# Altium schematic sheet Audio-Beamformer_USB_V1.0.SchDoc: Audio-Beamformer
size A4; PageSetup: Record=PageOptions|CenterHorizontal=True|CenterVertical=True|PrintScale=0.97|XCorrection=1.00|YCorrection=1.00|PrintKind=0|BorderSize=5000000|LeftOffset=0|BottomOffset=0|Orientation=2|PaperLength=1000|PaperWidth=1000|Scale=100|PaperSource=7|PrintQuality=-3|MediaType=1|DitherType=10|PrintScaleMode=1|PaperKind=A4|PaperIndex=9; Organization: Ostschweizer Fachhochschule; Address2: Florian Baumgartner & Thierry Schwaller; Address3: florian.baumgartner@ost.ch; DocumentNumber: 7; Revision: V1.0; SheetNumber: 7; SheetTotal: 10; Author: Florian Baumgartner & Thierry Schwaller; Subtitle: USB
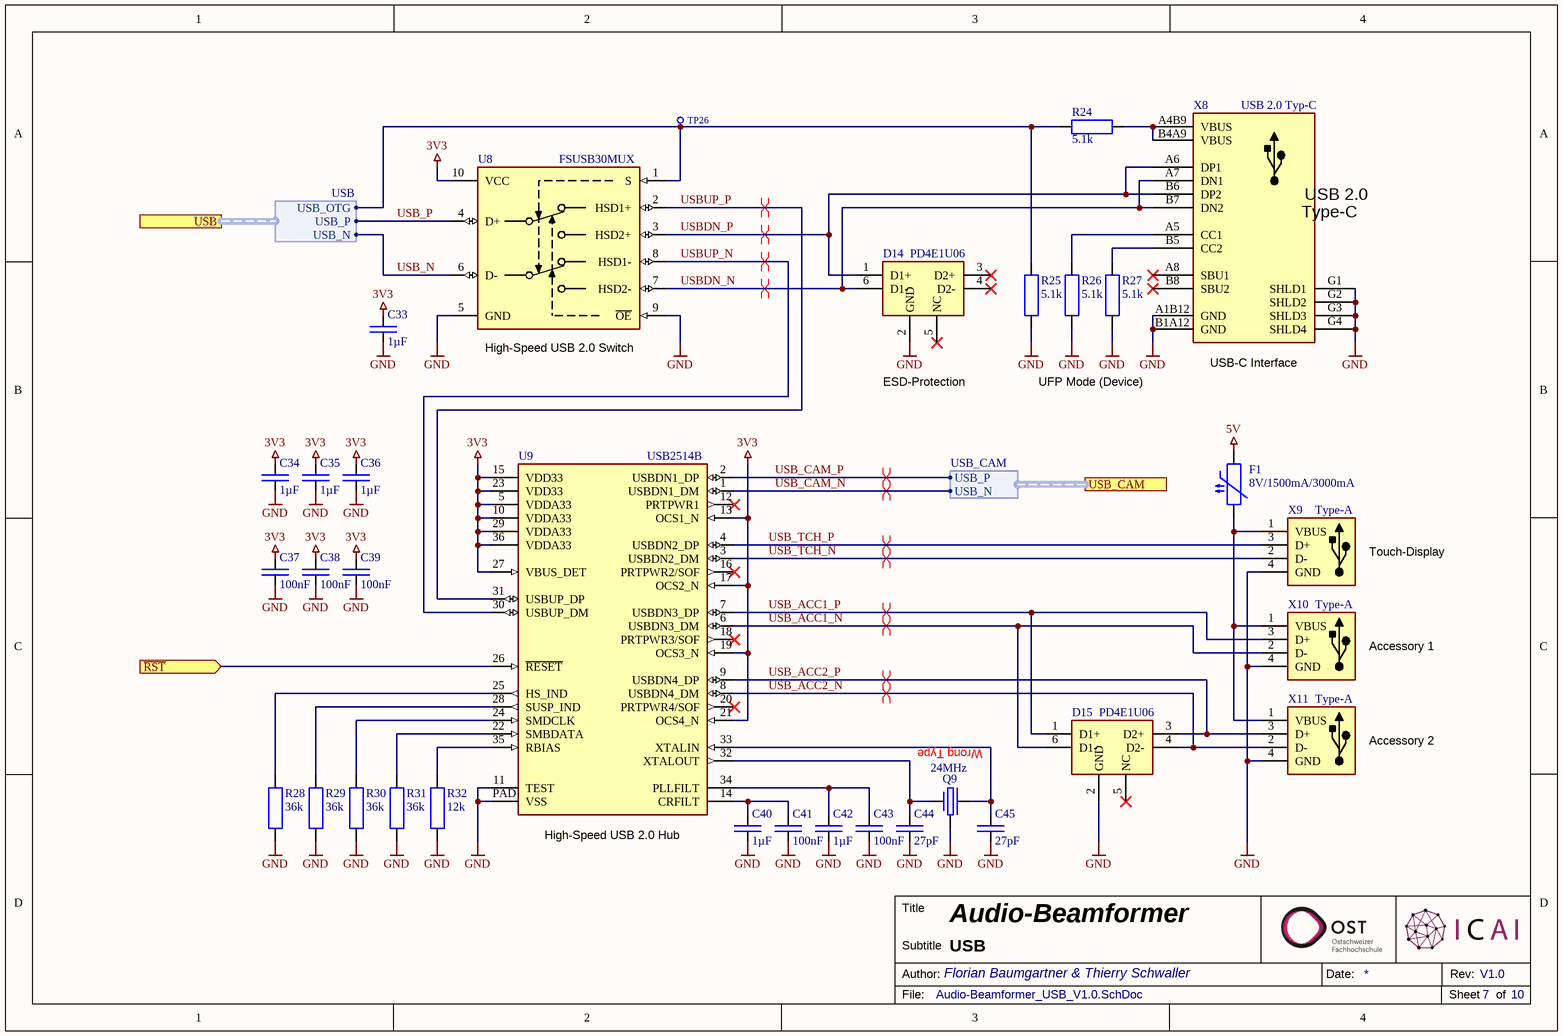
[diagram p0: Audio-Beamformer_USB_V1.0.SchDoc]

## Parts
C33  1µF  [SMD Keramikkondensator 0603]
C34  1µF  [SMD Keramikkondensator 0603]
C35  1µF  [SMD Keramikkondensator 0603]
C36  1µF  [SMD Keramikkondensator 0603]
C37  100nF  [SMD Keramikkondensator 0603]
C38  100nF  [SMD Keramikkondensator 0603]
C39  100nF  [SMD Keramikkondensator 0603]
C40  1µF  [SMD Keramikkondensator 0603]
C41  100nF  [SMD Keramikkondensator 0603]
C42  1µF  [SMD Keramikkondensator 0603]
C43  100nF  [SMD Keramikkondensator 0603]
C44  27pF  [SMD Keramikkondensator 0603]
C45  27pF  [SMD Keramikkondensator 0603]
D14  PD4E1U06  [SMD IC SOT-363 (SC-70-6)]
D15  PD4E1U06  [SMD IC SOT-363 (SC-70-6)]
F1  8V/1500mA/3000mA  [SMD PPTC-Fuse 1206]
Q9  24MHz  [SMD Crystal 3.2X2.5X0.8]
R24  5.1k  [SMD Widerstand 0603]
R25  5.1k  [SMD Widerstand 0603]
R26  5.1k  [SMD Widerstand 0603]
R27  5.1k  [SMD Widerstand 0603]
R28  36k  [SMD Widerstand 0603]
R29  36k  [SMD Widerstand 0603]
R30  36k  [SMD Widerstand 0603]
R31  36k  [SMD Widerstand 0603]
R32  12k  [SMD Widerstand 0603]
TP26  X-TP  [THT Testpunkt Ø1mm]  (value not drawn)  (no BOM)
U8  FSUSB30MUX  [SMD IC MSOP-10]
U9  USB2514B  [SMD IC VFQFN-36]
X8  USB 2.0 Typ-C  [SMD USB-C Socket (A40-00119)]
X9  Type-A  [THT USB-A (292303-1)]
X10  Type-A  [THT USB-A (292303-1)]
X11  Type-A  [THT USB-A (292303-1)]

## Ports
USB (harness USB), USB_CAM (harness USB_CAM), ~{RST} (in)

## Harnesses
USB_CAM: USB_N, USB_P
USB: USB_N, USB_P, USB_OTG

## Nets
3V3: C33.2 C34.2 C35.2 C36.2 C37.2 C38.2 C39.2 U8.10(VCC) U9.5(VDDA33) U9.10(VDDA33) U9.13(OCS1_N) U9.15(VDD33) U9.17(OCS2_N) U9.19(OCS3_N) U9.21(OCS4_N) U9.23(VDD33) U9.27(VBUS_DET) U9.29(VDDA33) U9.36(VDDA33)
5V: F1.2
GND: C33.1 C34.1 C35.1 C36.1 C37.1 C38.1 C39.1 C40.1 C41.1 C42.1 C43.1 C44.2 C45.2 D14.2(GND) D15.2(GND) Q9.3 R25.2 R26.2 R27.2 R28.1 R29.1 R30.1 R31.1 R32.1 U8.5(GND) U8.9(~{OE}) U9.11(TEST) U9.PAD(VSS) X8.A1B12(GND) X8.B1A12(GND) X8.G1(SHLD1) X8.G2(SHLD2) X8.G3(SHLD3) X8.G4(SHLD4) X9.4(GND) X10.4(GND) X11.4(GND)
~{RST}: U9.26(~{RESET}) ; port ~{RST}
USB_ACC1_N: D15.6(D1-) U9.6(USBDN3_DM) X10.2(D-)
USB_ACC1_P: D15.1(D1+) U9.7(USBDN3_DP) X10.3(D+)
USB_ACC2_N: D15.4(D2-) U9.8(USBDN4_DM) X11.2(D-)
USB_ACC2_P: D15.3(D2+) U9.9(USBDN4_DP) X11.3(D+)
USB_CAM_N: U9.1(USBDN1_DM) ; port USB_CAM.USB_N
USB_CAM_P: U9.2(USBDN1_DP) ; port USB_CAM.USB_P
USB_N: U8.6(D-) ; port USB.USB_N
USB_P: U8.4(D+) ; port USB.USB_P
USB_TCH_N: U9.3(USBDN2_DM) X9.2(D-)
USB_TCH_P: U9.4(USBDN2_DP) X9.3(D+)
USBDN_N: D14.6(D1-) U8.7(HSD2-) X8.A7(DN1) X8.B7(DN2)
USBDN_P: D14.1(D1+) U8.3(HSD2+) X8.A6(DP1) X8.B6(DP2)
USBUP_N: U8.8(HSD1-) U9.30(USBUP_DM)
USBUP_P: U8.2(HSD1+) U9.31(USBUP_DP)
NetC40_2: C40.2 C41.2 U9.14(CRFILT)
NetC42_2: C42.2 C43.2 U9.34(PLLFILT)
NetC44_1: C44.1 Q9.1 U9.32(XTALOUT)
NetC45_1: C45.1 Q9.2 U9.33(XTALIN)
NetF1_1: F1.1 X9.1(VBUS) X10.1(VBUS) X11.1(VBUS)
NetR24_1: R24.1 R25.1 TP26.1 U8.1(NC) ; port USB.USB_OTG
NetR24_2: R24.2 X8.A4B9(VBUS) X8.B4A9(VBUS)
NetR26_1: R26.1 X8.A5(CC1)
NetR27_1: R27.1 X8.B5(CC2)
NetR28_2: R28.2 U9.25(HS_IND)
NetR29_2: R29.2 U9.28(SUSP_IND)
NetR30_2: R30.2 U9.24(SMDCLK)
NetR31_2: R31.2 U9.22(SMBDATA)
NetR32_2: R32.2 U9.35(RBIAS)

Not connected (* = marked no-connect by the designer): D14 3(D2+)* 4(D2-)* 5(NC)*; D15 5(NC)*; U9 12(PRTPWR1)* 16(PRTPWR2/SOF)* 18(PRTPWR3/SOF)* 20(PRTPWR4/SOF)*; X8 A8(SBU1)* B8(SBU2)*

## Layout directives
differential pair: USB_ACC1_N, USB_ACC1_P, USB_ACC2_N, USB_ACC2_P, USB_CAM_N, USB_CAM_P, USB_TCH_N, USB_TCH_P, USBDN_N, USBDN_P, USBUP_N, USBUP_P

## Notes on the sheet
- (near U8) High-Speed USB 2.0 Switch
- ESD-Protection
- UFP Mode (Device)
- (near X8) USB-C Interface
- Touch-Display
- Accessory 1
- (near Q9) Wrong Type
- Accessory 2
- (near U9) High-Speed USB 2.0 Hub
- Title
- Author:
- Subtitle
- Date:
- Rev:
- File:
- Sheet
- of
- (in symbol X-USB-Buchse) USB 2.0; Type-C

## Library data of the parts
C33-C36 C40 C42 = E6 - 1uF: SMD Ceramic Capacitor E6; Component Value: 1µF 50V; Component Description: Multilayer Ceramic Capacitors MLCC; ComponentLink1Description: Datasheet; ComponentLink1URL: https://datasheet.lcsc.com/lcsc/1810261812_Samsung-Electro-Mechanics-CL10A105KB8NNNC_C15849.pdf; Digikey: 1276-1860-1-ND; Farnell: 3013383; JLC-Parts: C15849; Mouser: 187-CL10A105KB8NNNC; Unit Price: 0.01
C37-C39 C41 C43 = C-CAPACITOR: CAP-MK; Component Description: Multilayer Ceramic Capacitors; Component Value: 100nF 50V; Digikey: 445-5666-1-ND; Farnell: 2522432; Mouser: 77-VJ0603V104ZXAPBC; JLC-Parts: C14663; Unit Price: 0.01
C44 C45 = C-CAPACITOR: CAP-MK; Component Description: Multilayer Ceramic Capacitors; Component Value: 27pF 50V; Digikey: 399-C0603C270J5GAC7867CT-ND; Farnell: 1414627; Mouser: 80-C0603C270J5G; JLC-Parts: C1656; Unit Price: 0.01
D14 D15 = PD4E1U06DCKR: Unidirectional 3A (8/20us) 15V (Typ) 6.5V 5.5V (Max) SOT-363 ESD Protection Devices ROHS; Component Description: ESD Suppressor; ComponentLink1Description: Datasheet; ComponentLink1URL: https://datasheet.lcsc.com/lcsc/1810172210_Texas-Instruments-TPD4E1U06DCKR_C194628.pdf; Component Value: PD4E1U06; Digikey: 296-39347-1-ND; Farnell: 3116516; JLC-Parts: C194628; Mouser: 595-TPD4E1U06DCKR; Unit Price: 0.12
F1 = nSMD020-30V: 8V/1500mA/3000mA Resettable Fuses; Component Value: 8V/1500mA/3000mA/100ms; Component Description: PTC Resettable Fuse; ComponentLink1Description: Datasheet; ComponentLink1URL: https://www.littelfuse.com/~/media/electronics/datasheets/resettable_ptcs/littelfuse_ptc_1206l_datasheet.pdf.pdf; Digikey: F3372CT-ND; Farnell: 2383296; JLC-Parts: C118413; Mouser: 576-1206L150THWR; Unit Price: 0.07
Q9 = B-QUARZ-CAP: Component Description: Crystal; Digikey: XC2310CT-ND; Farnell: 3649756; Mouser: 520-240-18-33-JGNT; ComponentLink1Description: Datasheet; ComponentLink1URL: https://datasheet.lcsc.com/lcsc/1810170919_TKD-SX32Y024000BC1T_C271629.pdf; Component Value: 24Mhz; JLC-Parts: C271629; Unit Price: 0.11
R24-R27 = R-RESISTOR: RES (E=Heizwiderstand B=Messwandler); Component Description: Thick Film Chip Resistor; Component Value: 5.1k (75V, 100mW, 1%); Digikey: P5.10KHCT-ND; Farnell: 2059378; Mouser: 667-ERJ-3EKF5101V; JLC-Parts: C23186; Unit Price: 0.01
R28-R31 = R-RESISTOR: RES (E=Heizwiderstand B=Messwandler); Component Description: Thick Film Chip Resistor; Component Value: 36k (75V, 100mW, 1%); Digikey: P36.0KHCT-ND; Farnell: 2303207; Mouser: 667-ERJ-3EKF3602V; JLC-Parts: C23147; Unit Price: 0.01
R32 = R-RESISTOR: RES (E=Heizwiderstand B=Messwandler); Component Description: Thick Film Chip Resistor; Component Value: 12k (75V, 100mW, 1%); Digikey: P12.0KHCT-ND; Farnell: 2303195; Mouser: 667-ERJ-3EKF1202V; JLC-Parts: C22790; Unit Price: 0.01
TP26 = X-TP: Testpunkt; Component Description: Testpoint; Component Value: Ø 0.8mm; Unit Price: 0.00
U8 = U-FSUSB30MUX: High Speed USB 2.0 Switch; Digikey: FSUSB30MUXCT-ND; Farnell: 1495465; Mouser: 512-FSUSB30MUX; Component Description: High Speed USB 2.0 Switch; ComponentLink1Description: Datasheet; ComponentLink1URL: https://datasheet.lcsc.com/lcsc/1809111813_onsemi-FSUSB30MUX_C11143.pdf; Component Value: FSUSB30MUX; JLC-Parts: C11143; Unit Price: 0.41
U9 = U-USB2514B: USB 2.0 Hi-Speed Hub Controller; Component Value: USB2514B-AEZC-TR; Digikey: USB2514B-AEZC-CT-ND; Farnell: 2775061; Mouser: 886-USB2514B-AEZC-TR; Component Description: USB 2.0 Hi-Speed Hub Controller; ComponentLink1Description: Datasheet; ComponentLink1URL: https://datasheet.lcsc.com/lcsc/1809200030_Microchip-Tech-USB2514B-AEZC-TR_C16251.pdf; JLC-Parts: C16251; Unit Price: 6.37
X8 = X-USB-Buchse: Typ-C; aliExpress: 33045191307; Component Description: USB Connector Type-C; Component Value: USB4105-GF-A; Digikey: 2073-USB4105-GF-ACT-ND; Farnell: 3583366; ComponentLink1Description: Datasheet; ComponentLink1URL: https://datasheet.lcsc.com/lcsc/2103051833_Jing-Extension-of-the-Electronic-Co--918-418K2023S40001_C167321.pdf; JLC-Parts: C167321; Unit Price: 0.34
X9-X11 = X-USB-Type-A: Component Value: 292303-1; Component Description: USB Connector Type-A; Digikey: A31726-ND; Farnell: 1076663; Mouser: 571-292303-1; Unit Price: 0.45; ComponentLink1Description: Datasheet; ComponentLink1URL: https://datasheet.lcsc.com/lcsc/1811131820_TE-Connectivity-292303-1_C86461.pdf; JLC-Parts: C86461